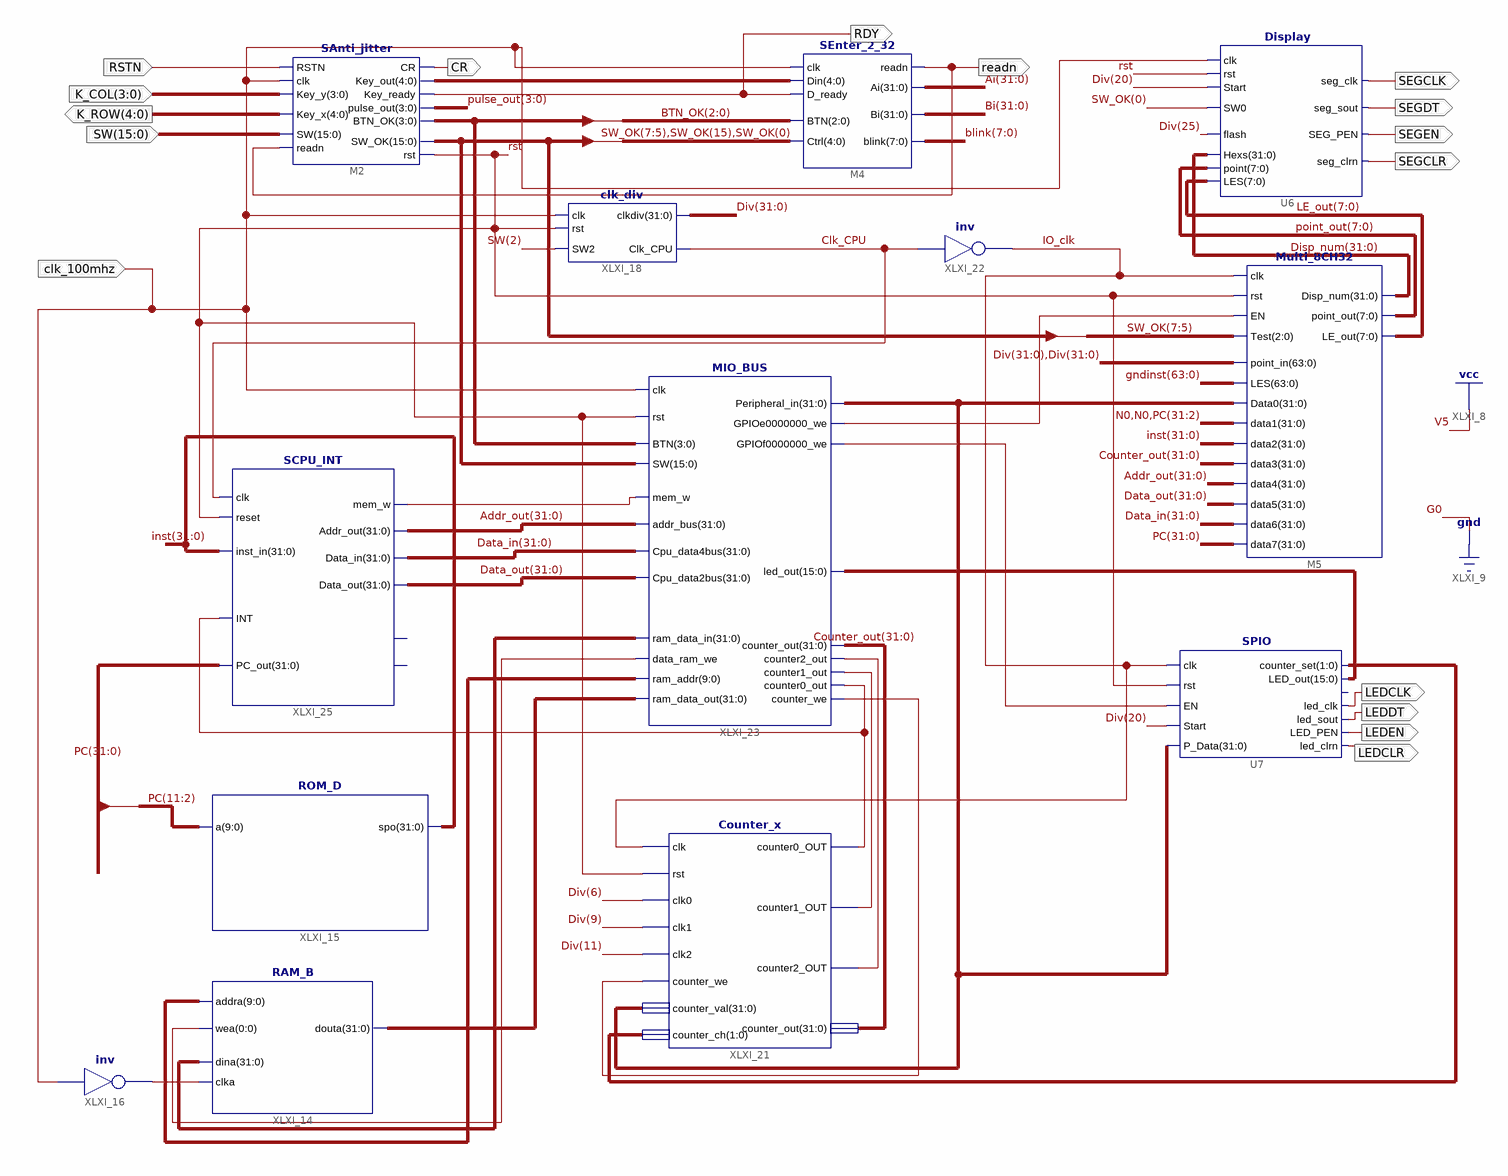
[diagram p0: schematic sheet 1]
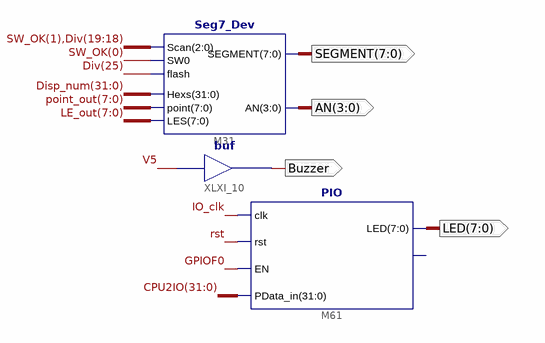
[diagram p1: schematic sheet 2]
// Xilinx ISE schematic Main.sch (kintex7) as structural Verilog: 16 symbols, 20 ports
module Main (
  input  RSTN,
  input  [3:0] K_COL,
  input  [15:0] SW,
  input  clk_100mhz,
  output [4:0] K_ROW,
  output CR,
  output readn,
  output SEGCLK,
  output SEGDT,
  output SEGEN,
  output SEGCLR,
  output LEDCLK,
  output LEDCLR,
  output RDY,
  output LEDDT,
  output LEDEN,
  output [7:0] LED,
  output Buzzer,
  output [7:0] SEGMENT,
  output [3:0] AN
);

  wire Clk_CPU, GPIOF0, IO_clk, N0, rst, XLXN_117, XLXN_124, XLXN_129, XLXN_130, XLXN_131, XLXN_157,
       XLXN_166, XLXN_168;
  wire [0:0] XLXN_144;
  wire [1:0] XLXN_135;
  wire [3:0] BTN_OK, pulse_out;
  wire [4:0] XLXN_43;
  wire [7:0] blink, LE_out, point_out;
  wire [9:0] XLXN_141;
  wire [15:0] SW_OK, XLXN_134;
  wire [31:0] Addr_out, Ai, Bi, Counter_out, CPU2IO, Data_in, Data_out, Disp_num, Div, inst, PC, XLXN_142,
       XLXN_145, XLXN_150;
  wire [63:0] gndinst;

  SAnti_jitter M2 (
    .SW(SW), .readn(readn), .Key_y(K_COL), .Key_x(K_ROW), .RSTN(RSTN), .clk(clk_100mhz), .Key_out(XLXN_43),
    .Key_ready(RDY), .CR(CR), .rst(rst), .SW_OK(SW_OK), .pulse_out(pulse_out), .BTN_OK(BTN_OK));
  SEnter_2_32 M4 (
    .readn(readn), .Ai(Ai), .Bi(Bi), .blink(blink), .Din(XLXN_43), .D_ready(RDY), .clk(clk_100mhz),
    .Ctrl({SW_OK[7:5], SW_OK[15], SW_OK[0]}), .BTN(BTN_OK[2:0]));
  Display U6 (
    .LES(LE_out), .SEG_PEN(SEGEN), .seg_sout(SEGDT), .seg_clrn(SEGCLR), .point(point_out), .Hexs(Disp_num),
    .SW0(SW_OK[0]), .flash(Div[25]), .seg_clk(SEGCLK), .clk(clk_100mhz), .rst(rst), .Start(Div[20]));
  Multi_8CH32 M5 (
    .Test(SW_OK[7:5]), .point_in({Div, Div}), .EN(XLXN_168), .clk(IO_clk), .rst(rst), .LES(gndinst),
    .Data0(XLXN_150), .data1({{2{N0}}, PC[31:2]}), .data2(inst), .data3(Counter_out), .data4(Addr_out),
    .data5(Data_out), .data6(Data_in), .data7(PC), .point_out(point_out), .LE_out(LE_out), .Disp_num(Disp_num));
  SPIO U7 (
    .clk(IO_clk), .P_Data(XLXN_150), .rst(rst), .EN(XLXN_157), .Start(Div[20]), .led_clk(LEDCLK),
    .LED_out(XLXN_134), .counter_set(XLXN_135), .led_clrn(LEDCLR), .LED_PEN(LEDEN), .led_sout(LEDDT));  // open: GPIOf0
  RAM_B XLXI_14 (.addra(XLXN_141), .clka(XLXN_117), .wea(XLXN_144[0]), .dina(XLXN_145), .douta(XLXN_142));
  ROM_D XLXI_15 (.a(PC[11:2]), .spo(inst));
  not XLXI_16 (XLXN_117, clk_100mhz);
  clk_div XLXI_18 (.rst(rst), .clk(clk_100mhz), .SW2(SW[2]), .clkdiv(Div), .Clk_CPU(Clk_CPU));
  Seg7_Dev M31 (
    .LES(LE_out), .Scan({SW_OK[1], Div[19:18]}), .SEGMENT(SEGMENT), .AN(AN), .point(point_out),
    .flash(Div[25]), .SW0(SW_OK[0]), .Hexs(Disp_num));
  PIO M61 (.clk(IO_clk), .rst(rst), .EN(GPIOF0), .PData_in(CPU2IO), .LED(LED));  // open: GPIOf0
  buf XLXI_10 (Buzzer, 1'b1);
  Counter_x XLXI_21 (
    .clk(IO_clk), .rst(rst), .clk0(Div[6]), .clk1(Div[9]), .clk2(Div[11]), .counter_we(XLXN_166),
    .counter_val(XLXN_150), .counter_ch(XLXN_135), .counter0_OUT(XLXN_131), .counter1_OUT(XLXN_129),
    .counter2_OUT(XLXN_130), .counter_out(Counter_out));
  not XLXI_22 (IO_clk, Clk_CPU);
  MIO_BUS XLXI_23 (
    .rst(rst), .clk(clk_100mhz), .mem_w(XLXN_124), .addr_bus(Addr_out), .Cpu_data4bus(Data_in),
    .Cpu_data2bus(Data_out), .ram_data_out(XLXN_142), .ram_addr(XLXN_141), .data_ram_we(XLXN_144[0]),
    .ram_data_in(XLXN_145), .counter_out(Counter_out), .counter2_out(XLXN_130), .counter1_out(XLXN_129),
    .counter0_out(XLXN_131), .counter_we(XLXN_166), .BTN(BTN_OK), .SW(SW_OK), .led_out(XLXN_134),
    .Peripheral_in(XLXN_150), .GPIOe0000000_we(XLXN_168), .GPIOf0000000_we(XLXN_157));
  SCPU_INT XLXI_25 (
    .clk(Clk_CPU), .reset(rst), .inst_in(inst), .INT(XLXN_131), .Addr_out(Addr_out), .mem_w(XLXN_124),
    .Data_out(Data_out), .Data_in(Data_in), .PC_out(PC));  // open: CPU_MIO, MIO_ready
endmodule
